# Altium project SDP21_Trinamic_Driver_Board.PrjPcb
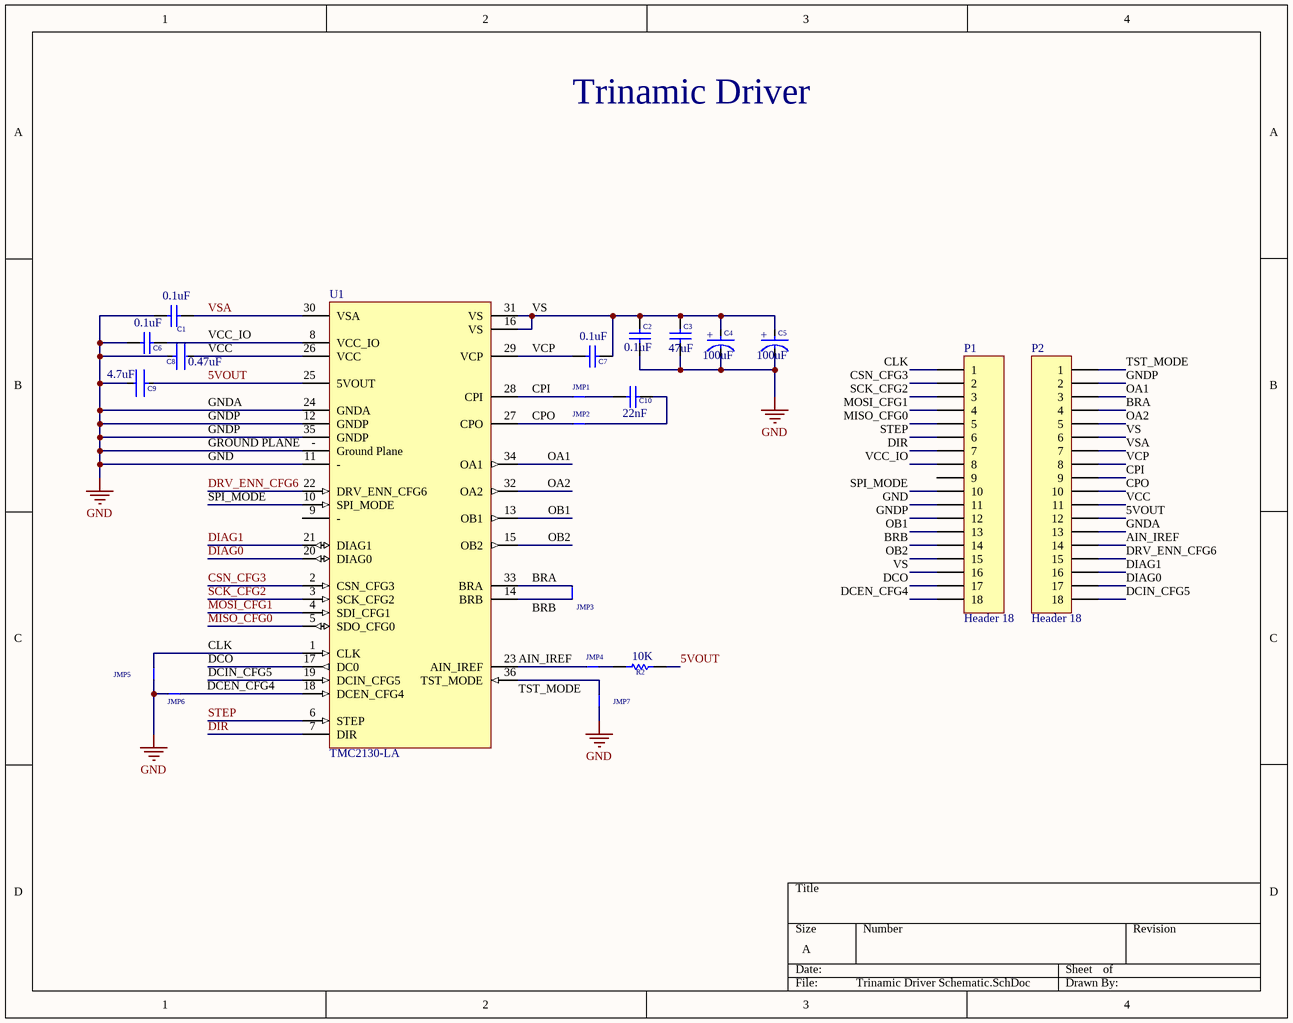
[diagram p0: Trinamic Driver Schematic.SchDoc]
1 sheet, 21 parts. Net scope: global (net labels, ports and power ports of the same name join across sheets).
Board file: Trinamic Driver PCB.PcbDoc

## Sheet Trinamic Driver Schematic.SchDoc
size A

### Parts
C1  0.1uF  [CAPC1608X90X20LL10]
C2  0.1uF  [CAPC1608X90X20LL10]
C3  47uF  [CAPC3225X270X50LL20T25]
C4  100uF  [FP-EEE-FK1H101P-MFG]
C5  100uF  [FP-EEE-FK1H101P-MFG]
C6  0.1uF  [CAPC1608X90X20LL10]
C7  0.1uF  [CAPC1608X90X20LL10]
C8  0.47uF  [FP-C0603C-CF-MFG]
C9  4.7uF  [FP-C0603-CG-MFG]
C10  22nF  [CAPC1608X90X40ML10T20]
JMP1  Solder Jump  [Solder Jump]  (value not drawn)
JMP2  Solder Jump  [Solder Jump]  (value not drawn)
JMP3  Solder Jump  [Solder Jump]  (value not drawn)
JMP4  Solder Jump  [Solder Jump]  (value not drawn)
JMP5  Solder Jump  [Solder Jump]  (value not drawn)
JMP6  Solder Jump  [Solder Jump]  (value not drawn)
JMP7  Solder Jump  [Solder Jump]  (value not drawn)
P1  Header 18  [HDR1X18]
P2  Header 18  [HDR1X18]
R2  10K  [RESC1609X55X30LL15T15]
U1  TMC2130-LA  [QFN-36]

### Nets
GND: C1.1 C2.1 C3.1 C4.1(C) C5.1(C) C6.1 C8.1 C9.2 JMP5.1 JMP6.2 JMP7.2 P1.11 P1.12 P2.2 P2.13 U1.11(-) U1.12(GNDP) U1.24(GNDA) U1.35(GNDP) U1.-(Ground_Plane)  [also labelled GNDA, GNDP, GROUND PLANE]
5VOUT: C9.1 P2.12 R2.2 U1.25(5VOUT)
AIN_IREF: JMP4.1 P2.14 U1.23(AIN_IREF)
BRA: JMP3.2 P2.4 U1.33(BRA)
BRB: JMP3.1 P1.14 U1.14(BRB)
CLK: JMP5.2 P1.1 U1.1(CLK)
CPI: JMP1.1 P2.9 U1.28(CPI)
CPO: JMP2.1 P2.10 U1.27(CPO)
CSN_CFG3: P1.2 U1.2(CSN_CFG3)
DCEN_CFG4: JMP6.1 P1.18 U1.18(DCEN_CFG4)
DCIN_CFG5: P2.18 U1.19(DCIN_CFG5)
DCO: P1.17 U1.17(DC0)
DIAG0: P2.17 U1.20(DIAG0)
DIAG1: P2.16 U1.21(DIAG1)
DIR: P1.7 U1.7(DIR)
DRV_ENN_CFG6: P2.15 U1.22(DRV_ENN_CFG6)
MISO_CFG0: P1.5 U1.5(SDO_CFG0)
MOSI_CFG1: P1.4 U1.4(SDI_CFG1)
OA1: P2.3 U1.34(OA1)
OA2: P2.5 U1.32(OA2)
OB1: P1.13 U1.13(OB1)
OB2: P1.15 U1.15(OB2)
SCK_CFG2: P1.3 U1.3(SCK_CFG2)
SPI_MODE: P1.10 U1.10(SPI_MODE)
STEP: P1.6 U1.6(STEP)
TST_MODE: JMP7.1 P2.1 U1.36(TST_MODE)
VCC: C8.2 P2.11 U1.26(VCC)
VCC_IO: C6.2 P1.8 U1.8(VCC_IO)
VCP: C7.2 P2.8 U1.29(VCP)
VS: C2.2 C3.2 C4.2(A) C5.2(A) C7.1 P1.16 P2.6 U1.16(VS) U1.31(VS)
VSA: C1.2 P2.7 U1.30(VSA)
NetC10_1: C10.1 JMP1.2
NetC10_2: C10.2 JMP2.2
NetJMP4_2: JMP4.2 R2.1

Not connected (* = marked no-connect by the designer): P1 9; U1 9(-)

### Notes on the sheet
- Trinamic Driver
- (in symbol CMP-05427-000005-1) +

### Library data of the parts
C1 C2 C6 C7 = CMP-2000-07546-1: Chip Capacitor, 0.1 uF, +/- 10%, 50 V, -55 to 125 degC, 0603 (1608 Metric), RoHS, Tape and Reel; Manufacturer: TDK; Capacitance: 100nF; Voltage: 50V; Dielectric: X7R; Package Reference: 603; Radiation Hardening: No; Composition: Ceramic; Datasheet URL: https://product.tdk.com/info/en/catalog/datasheets/mlcc_automotive_general_en.pdf; Mounting Technology: SurfaceMount; Datasheet Version: 12/2014; Width: 0.8mm; Length: 1.6mm; Tolerance: 10%; Case Code (Imperial): 0603; RoHSCompliant: True; Min Operating Temperature: -55degC; Package Description: 2-Pin Surface Mount Device, Body 1.6 x 0.8 mm; Packaging: TapeandReel; Package Quantity: 1; Voltage Rating: 50V; Mount: SurfaceMount; Lead Free: LeadFree; Depth: 0.8mm; Termination: SMD/SMT; Case Code (Metric): 1608; Thickness: 0.035inch; Height: 0.8mm; Weight: 7.1E-05oz; Voltage Rating (DC): 50V; REACH SVHC: NoSVHC; Manufacturer URL: http://www.tdk.com/; Case/Package: 0603; Max Operating Temperature: 125degC
C3 = CMP-2000-06020-1: Chip Capacitor, 47 uF, +/- 20%, 16 V, -55 to 85 degC, 1210 (3225 Metric), RoHS, Tape and Reel; Manufacturer: Kemet; Capacitance: 47µF; Catalog Drawings: ACTU_1210; Product Training Modules: CapacitorBasics-TypicalUsesforCapacitors; Temperature Coefficient: X5R; Other Names: 399-5514-6; Online Catalog: X5RDielectric(CommercialGrade); Voltage - Rated: 16V; Manufacturer URL: http://www.kemet.com/; Applications: GeneralPurpose; Lead Style: -; Package / Case: 1210(3225Metric); Mounting Type: SurfaceMount,MLCC; Features: -; Ratings: -; Thickness (Max): 0.110"(2.80mm); Package Description: 2-Pin Surface Mount Device, Body 3.2 x 2.5 mm; Tolerance: ±20%; Datasheet URL: http://www.datasheets360.com/pdf/-8690541728068054270; Packaging: Digi-Reel®; Height - Seated (Max): -; Mounting Technology: SurfaceMount; Operating Temperature: -55°C~85°C; Standard Package: 1; Lead Spacing: -; Family: CeramicCapacitors; Size / Dimension: 0.126"Lx0.098"W(3.20mmx2.50mm); Series: C; Category: Capacitors; Package Reference: 1210; Datasheet Version: 05/2013
C4 C5 = CMP-05427-000005-1: CAP ALUM 100UF 20% 50V SMD; Manufacturer Part Number: EEE-FK1H101P; Manufacturer: Panasonic Electronic Components; Automotive Grade: Grade 2; Dissipation Factor: 10%; Life: 2000Hours; Ripple Current: 350mA; Material: Aluminum; Esr: 0.34Ω; Leakage Current: 50uA; Tolerance: 20%; Package: 0; ComponentLink2URL: https://industrial.panasonic.com/cdbs/www-data/pdf/RDE0000/ABA0000C1181.pdf; Temperature Range Low: -55°C; Voltage Rating: 50V; ComponentLink2Description: Datasheet; Category: Cap; Digikey Description: CAP ALUM 100UF 20% 50V SMD; Octopart: https://octopart.com/eeefk1h101p-panasonic-4642841; Automotive: Yes; Temperature: -55°C to +105°C; Capacitance: 100uF; Lead Free: Yes; Mouser Description: Cap Aluminum Lytic 100uF 50V 20% (8 X 10.2mm) SMD 350mA 2000h 105C Automotive T/R; Height: 10.5mm; Device Class L3: Aluminum Electrolytic Capacitors; Value: 100uF; Device Class L1: Passive Components; RoHS: TRUE; Device Class L2: Capacitors; Temperature Range High: +105°C
C8 = CMP-03020-024061-1: CAP CER 0.47UF 16V X7R 0603; Manufacturer Part Number: C0603C474K4RACTU; Manufacturer: KEMET; Automotive Grade: Grade 1; Value: 0.47 μF; Tolerance: 0.1; Temperature Coefficient: 30ppm/°C; Material: Ceramic; Device Class L3: Ceramic Capacitors; ComponentLink2URL: https://api.kemet.com/component-edge/download/datasheet/C0603C100J5GACAUTO.pdf; Height: 0.87mm; ComponentLink2Description: Datasheet; Device Class L2: Capacitors; Temperature Range Low: -55°C; Temperature Range High: +125°C; RoHS: TRUE; Mouser Description: 0603 C 470nF Ceramic Multilayer Capacitor, 16 V, +125degC, X7R Dielec, +/-10%; Temperature Characteristic: X7R; Digikey Description: CAP CER 0.47UF 16V X7R 0603; Lead Free: Yes; Automotive: Yes; Octopart: https://octopart.com/c0603c474k4ractu-kemet-109683; Capacitance: 0.47 μF; Package: C0603C-CF; Voltage Rating: 16 V; Device Class L1: Passive Components; Category: Cap; Temperature: -55°C to +125°C
C9 = CMP-03020-024641-1: CAP CER 4.7UF 6.3V X5R 0603; Manufacturer: Kemet; Manufacturer Part Number: C0603C475K9PACTU; Temperature Coefficient: 15%; Tolerance: 10%; Material: Ceramic; Device Class L3: Ceramic Capacitors; RoHS: TRUE; Value: 4.7uF; Lead Free: Yes; ComponentLink2Description: Datasheet; Mouser Description: Multilayer Ceramic Capacitors MLCC - SMD/SMT 6.3volts 4.7uF X5R 10%; Package: C0603-CG; Digikey Description: CAP CER 4.7UF 6.3V X5R 0603; ComponentLink2URL: https://content.kemet.com/datasheets/KEM_C1006_X5R_SMD.pdf; Category: Cap; Temperature Range Low: -55°C; Capacitance: 4.7uF; Temperature: -55°C to +85°C; Octopart: https://octopart.com/c0603c475k9pactu-kemet-104242; Ipc Land Pattern Name: CAPC16080X80; Voltage Rating: 6.3V; Temperature Range High: +85°C; Height: 0.9mm; Temperature Characteristic: X5R; Device Class L1: Passive Components; Automotive: No; Device Class L2: Capacitors
C10 = CMP-2100-03602-1: Chip Capacitor, 22 nF, +/- 10%, 50 V, -55 to 125 degC, 0603 (1608 Metric), RoHS, Tape and Reel; Manufacturer: Yageo; Voltage Rating (DC): 50V; Insulation Resistance: 100GR; Dielectric: X7R; Dielectric Material: Ceramic; REACH SVHC: NoSVHC; Datasheet Version: Rev. 15, 10/2016; Case Code (Imperial): 0603; Manufacturer URL: http://www.yageo.com/; Lead Free: LeadFree; Package Description: 2-Pin Surface Mount Device, Body 1.6 x 0.8 mm; Packaging: TapeandReel; RoHSCompliant: True; Depth: 0.8mm; Package Reference: 0603; Tolerance: 10%; Width: 0.031inch; Package Quantity: 1; Capacitance: 22nF; Number of Pins: 2; Voltage Rating: 50V; Datasheet URL: http://www.yageo.com/documents/recent/UPY-GPHC_X7R_6.3V-to-50V_15.pdf; Min Operating Temperature: -55degC; Max Operating Temperature: 125degC; Height: 0.8mm; Thickness: 0.035inch; Case Code (Metric): 1608; Radiation Hardening: No; Termination: SMD/SMT; Composition: Ceramic; Length: 1.6mm; Case/Package: 0603; Mount: SurfaceMount
P1 P2 = Header 18: Header, 18-Pin; LatestRevisionDate: 17-Jul-2002; LatestRevisionNote: Re-released for DXP Platform.; Publisher: Altium Limited
R2 = CMP-2000-07452-1: Chip Resistor, 10 KOhm, +/- 1%, 0.1 W, -55 to 155 degC, 0603 (1608 Metric), RoHS, Tape and Reel; Manufacturer: Panasonic; Voltage Rating: 75V; Case\/Package: 0603; Power Rating: 100mW; Resistance: 10KOhm; Temperature Coefficient: 100ppm\/degreesC; Number of Pins: 2; Package Reference: 603; Depth: 0.8mm; Mount: SurfaceMount; Package Description: 2-Pin Surface Mount Device, Body 1.6 x 0.85 mm; Datasheet Version: 02/2017; Length: 1.6mm; Lead Free: LeadFree; Height: 0.45mm; Number of Terminations: 2; Max Power Dissipation: 100mW; Min Operating Temperature: -55degC; Datasheet URL: https://industrial.panasonic.com/cdbs/www-data/pdf/RDA0000/AOA0000C304.pdf; Termination: SMD/SMT; Case Code (Metric): 1608; Case Code (Imperial): 0603; Tolerance: 1%; Max Operating Temperature: 155degC; RoHSCompliant: true; Voltage Rating (DC): 75V; Radiation Hardening: No; Packaging: TapeandReel; Composition: ThickFilm; Mounting Technology: SurfaceMount; Manufacturer URL: http://www.panasonic.com/; Width: 0.031inch; REACH SVHC: NoSVHC; Contact Plating: Tin; Military Standard: Not; Package Quantity: 1
U1 = TMC2130-LA: TMC2130-LA Trinamic Driver QFN-36